# EAGLE board Player (EAGLE 7.5.0), part 1 of 2
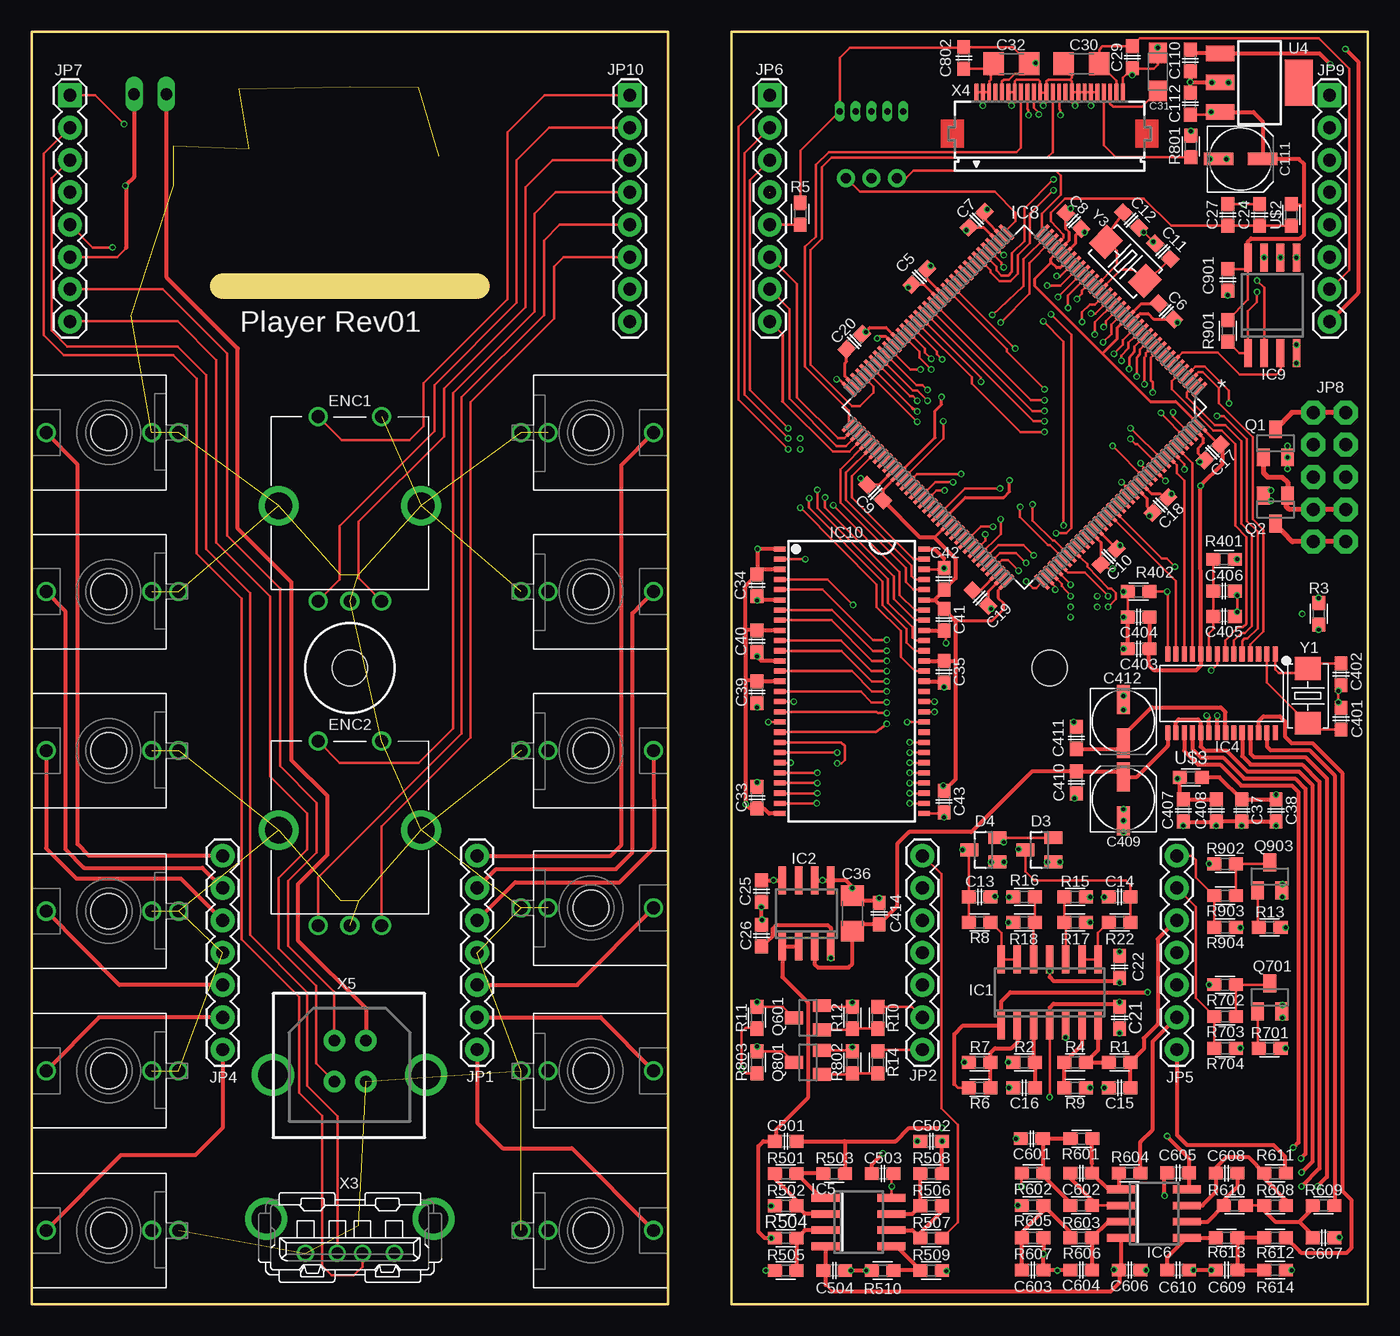
[diagram p3: board, top side]
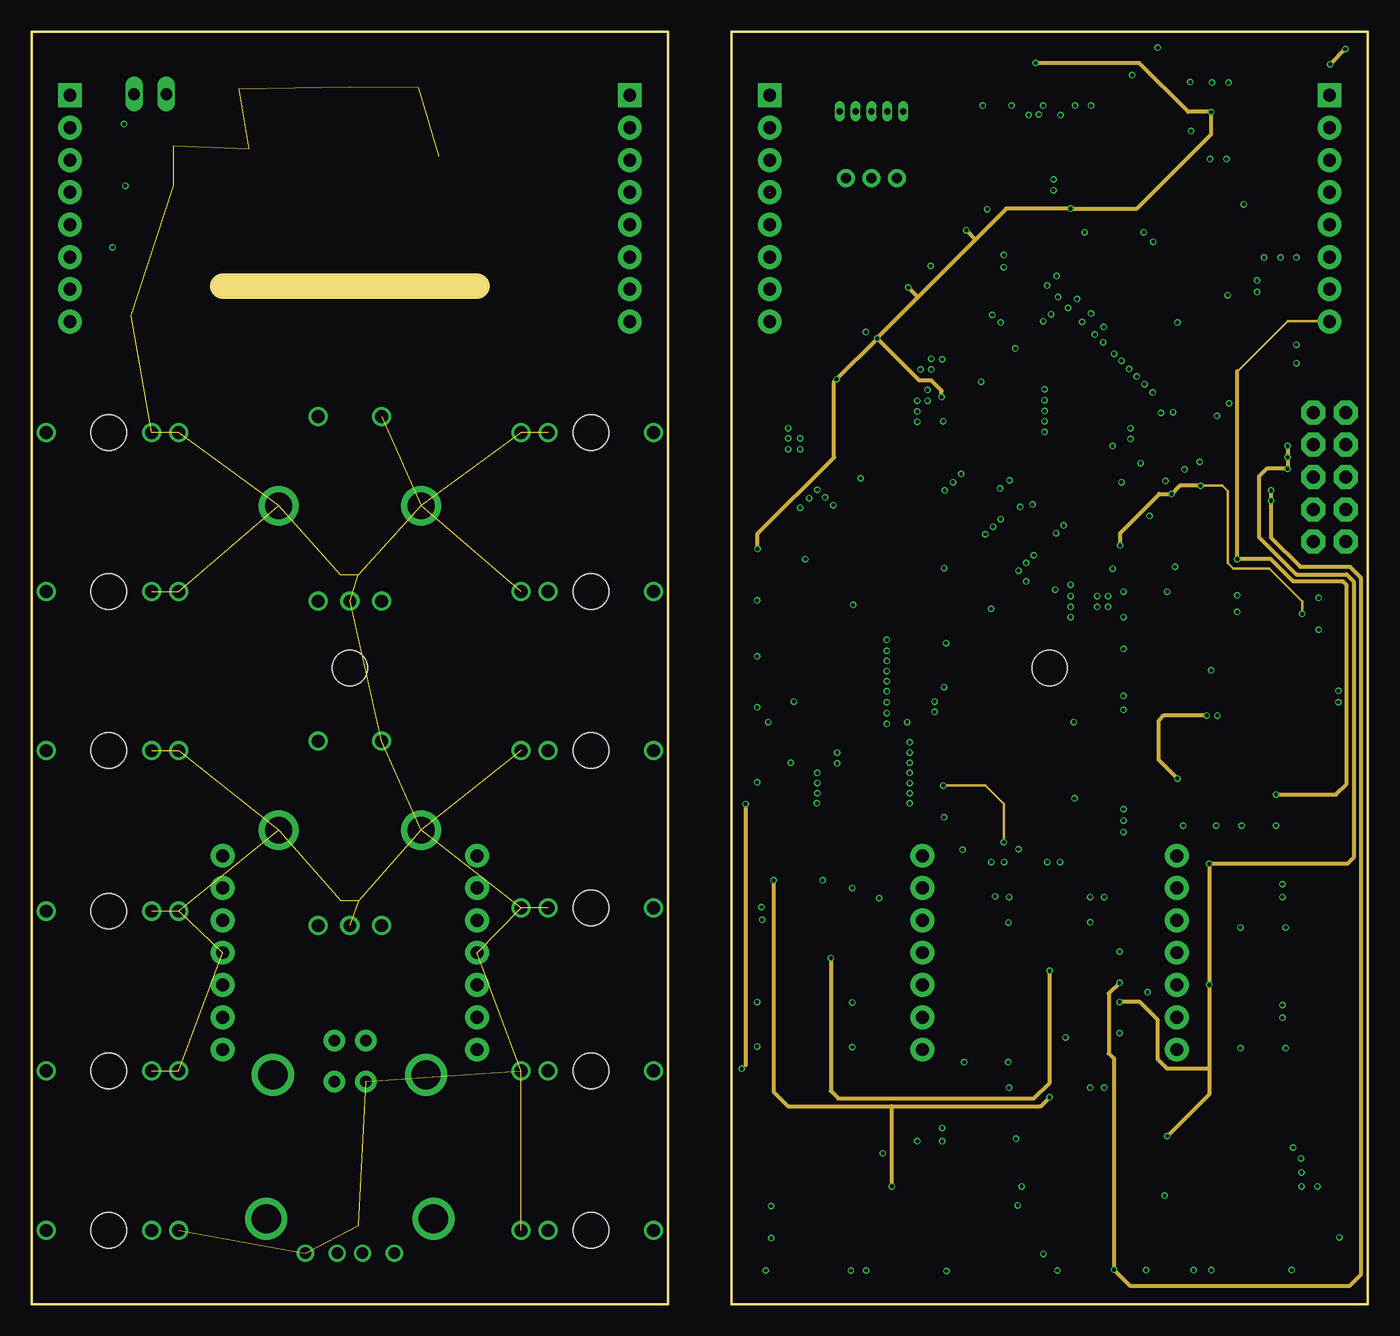
[diagram p4: board, inner layer InnerTop]
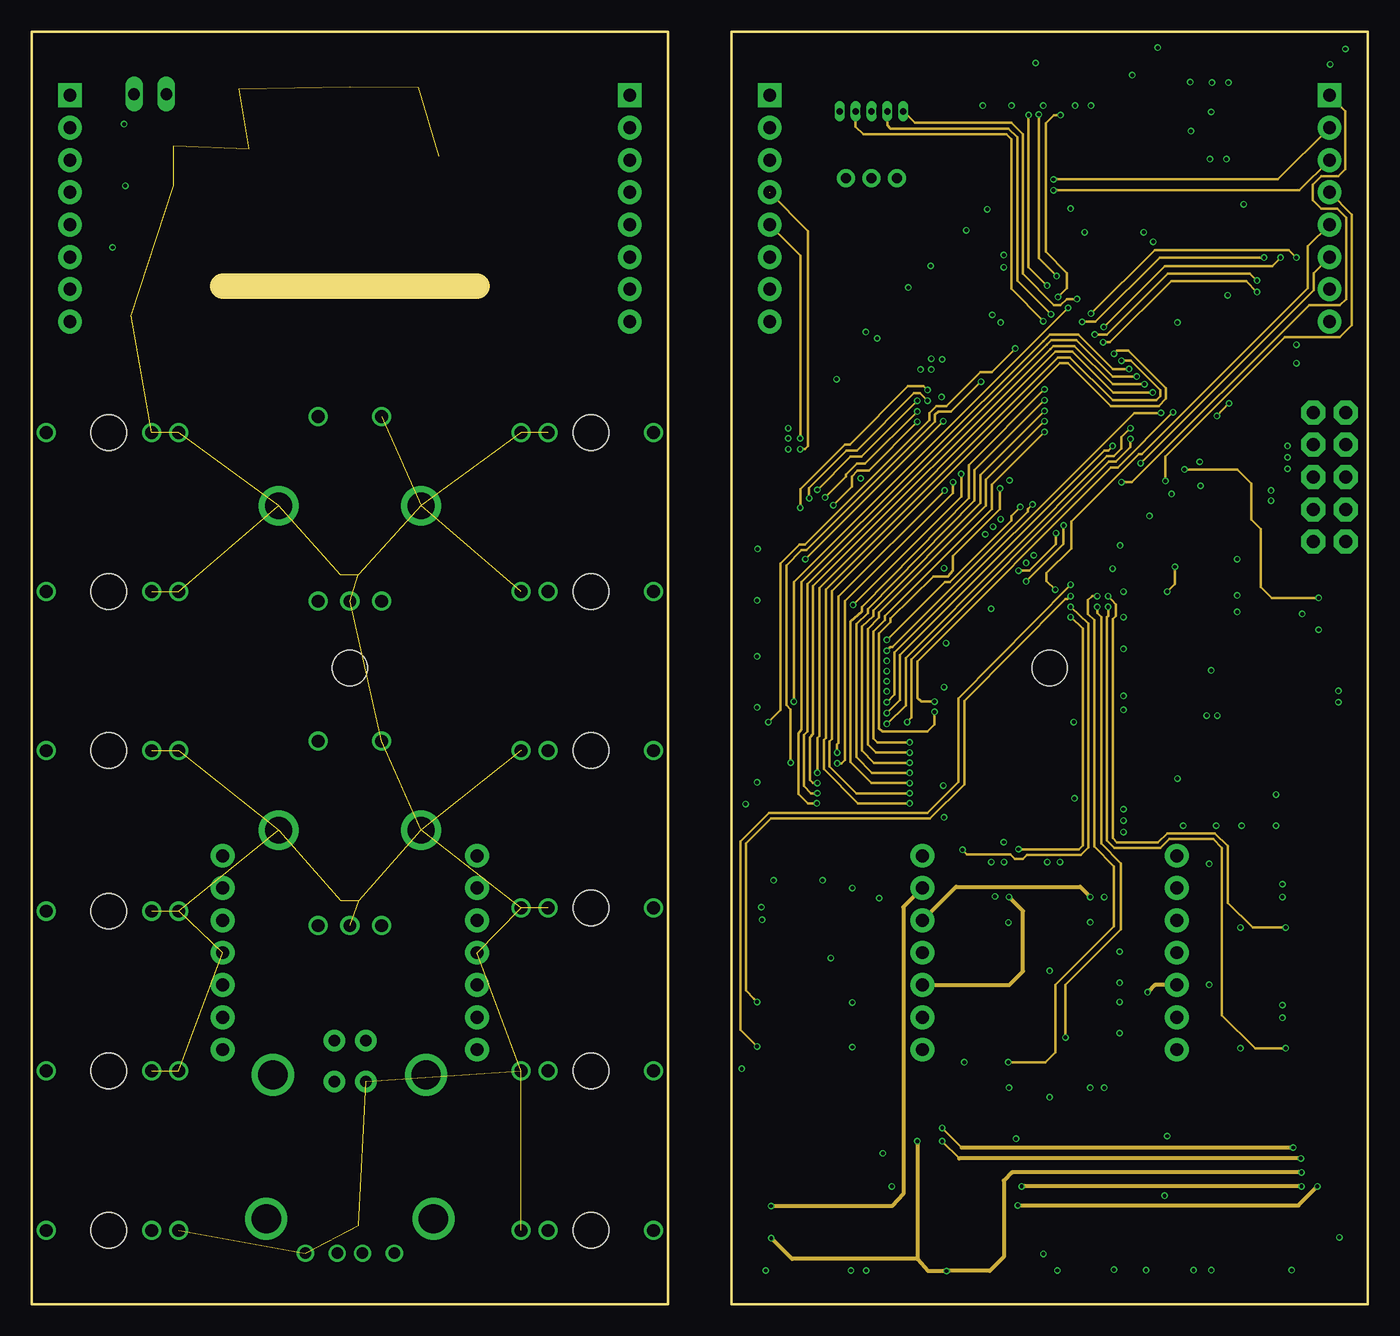
[diagram p5: board, inner layer InnerBottom]
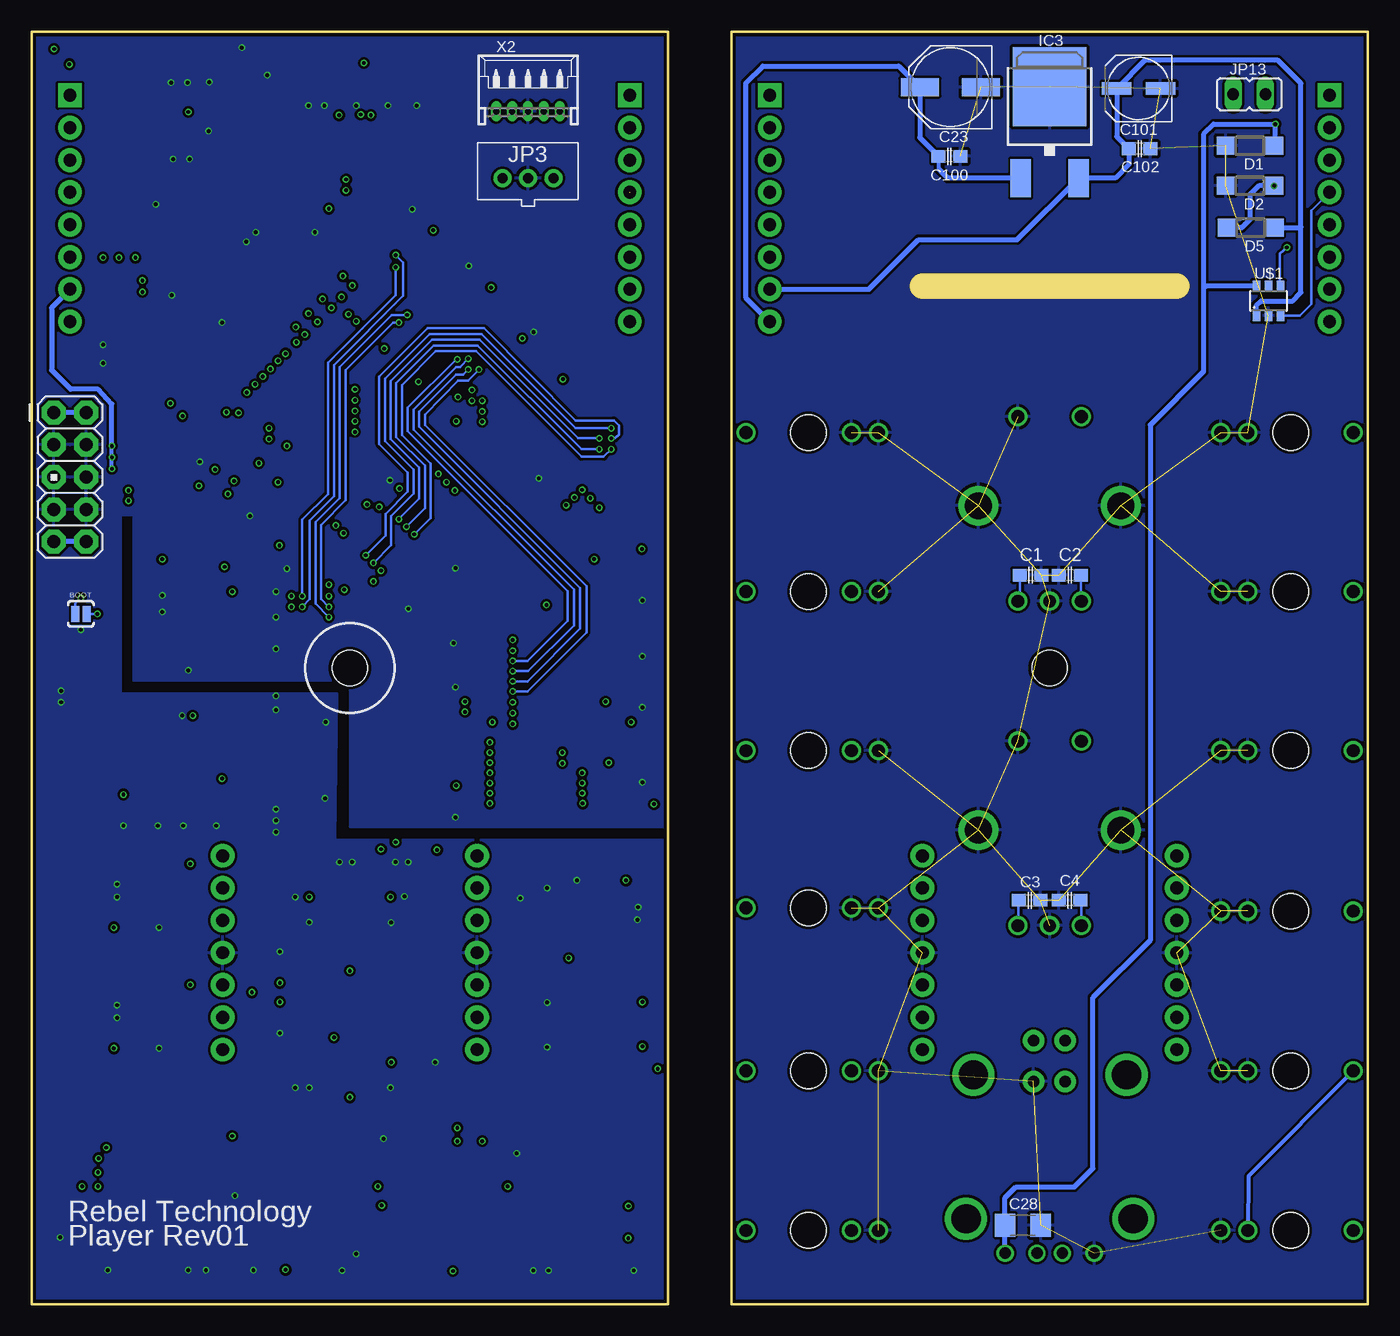
[diagram p6: board, bottom side, seen from below]

Size 105 x 100 mm. Coordinates in mm from the lower left corner, seen from the top.
Outline: 55,0 105,0 105,100 55,100 55,0
Outline: 50,100 0,100 0,0 50,0 50,100
Copper layers (1*2*15*16): Top 0.035mm / dielectric 0.2mm / InnerTop 0.0175mm / dielectric 0.3mm / InnerBottom 0.0175mm / dielectric 0.2mm / Bottom 0.035mm
Design rules "SeeedStudio_4layer_DRU_no_angle_20140221": minimum track width 8mil, minimum drill 12mil, track to track 8mil, track to pad 8mil, pad to pad 8mil, via to via 8mil, smd to smd 0mil, copper to edge 10mil, drill to drill 8mil, minimum pad ring 6mil, minimum via ring 4mil, stop-mask expansion 4mil, vias tented up to drill 25mil, thermal gap 10mil
Net classes: 1 power: width 0.178 mm, drill 0.305 mm, clearance 0.178 mm to class 0, clearance 0.178 mm
Holes 2.8 mm at 25,50 80,50
Milling: 1 lines

## Footprints (pad centres in the part's own frame; a part is rotated, then mirrored left to right if it is on the bottom)
SJ_2S-NO = smd 0.635 x 1.27: 1 -0.45,0; 2 0.45,0
C0603 = smd 1.1 x 1: 1 -0.85,0; 2 0.85,0
PANASONIC_D = smd 3 x 1.4: + 2.4,0; - -2.4,0
C1206 = smd 1.6 x 1.8: 1 -1.4,0; 2 1.4,0
SMC_A = smd 1.6 x 1.4: + -1.5,0; - 1.5,0
CPOL-5 = smd 2.3 x 1: + 1.725,0; - -1.725,0
THONKICONN = drill 1: P$1 0,-5.5; P$2 0,-3.38; P$3 0,4.92 | hole 2.8: 0,0
SOD123 = smd 1.4 x 1.4: A 1.9,0; C -1.9,0
SOT23 = smd 1 x 1.4: 1 -0.95,-1.1; 2 0.95,-1.1; 3 0,1.1
EC12E2424407 = drill 1: C 0,-7.5; PINA -2.5,-7.5; PINB 2.5,-7.5; SWITCH1 -2.5,7; SWITCH2 2.5,7 | drill 2.1: P$1 -5.6,0; P$2 5.6,0
SO14 = smd 0.6 x 2.2: 1 -3.81,-2.6; 2 -2.54,-2.6; 3 -1.27,-2.6; 4 0,-2.6; 5 1.27,-2.6; 6 2.54,-2.6; 7 3.81,-2.6; 8 3.81,2.6; 9 2.54,2.6; 10 1.27,2.6; 11 0,2.6; 12 -1.27,2.6; 13 -2.54,2.6; 14 -3.81,2.6
SO08 = smd 0.6 x 2.2: 1 -1.905,-2.6; 2 -0.635,-2.6; 3 0.635,-2.6; 4 1.905,-2.6; 5 1.905,2.6; 6 0.635,2.6; 7 -0.635,2.6; 8 -1.905,2.6
DPACK = smd 1.6 x 3: 1 -2.28,-4.8; 3 2.28,-4.8 | smd 5.8 x 6.2: 4 0,2.38
TSSOP28-0.65-9.7X4.4MM = smd 0.4 x 1.15: 1 -4.225,-3.1; 2 -3.575,-3.1; 3 -2.925,-3.1; 4 -2.275,-3.1; 5 -1.625,-3.1; 6 -0.975,-3.1; 7 -0.325,-3.1; 8 0.325,-3.1; 9 0.975,-3.1; 10 1.625,-3.1; 11 2.275,-3.1; 12 2.925,-3.1; 13 3.575,-3.1; 14 4.225,-3.1; 15 4.225,3.1; 16 3.575,3.1; 17 2.925,3.1; 18 2.275,3.1; 19 1.625,3.1; 20 0.975,3.1; 21 0.325,3.1; 22 -0.325,3.1; 23 -0.975,3.1; 24 -1.625,3.1; 25 -2.275,3.1; 26 -2.925,3.1; 27 -3.575,3.1; 28 -4.225,3.1
QFP50P2200X2200X160-144N = smd 1.473 x 0.279: 1 -10.719,8.738; 2 -10.719,8.255; 3 -10.719,7.747; 4 -10.719,7.239; 5 -10.719,6.756; 6 -10.719,6.248; 7 -10.719,5.74; 8 -10.719,5.258; 9 -10.719,4.75; 10 -10.719,4.242; 11 -10.719,3.759; 12 -10.719,3.251; 13 -10.719,2.743; 14 -10.719,2.261; 15 -10.719,1.753; 16 -10.719,1.245; 17 -10.719,0.762; 18 -10.719,0.254; 19 -10.719,-0.254; 20 -10.719,-0.762; 21 -10.719,-1.245; 22 -10.719,-1.753; 23 -10.719,-2.261; 24 -10.719,-2.743; 25 -10.719,-3.251; 26 -10.719,-3.759; 27 -10.719,-4.242; 28 -10.719,-4.75; 29 -10.719,-5.258; 30 -10.719,-5.74; 31 -10.719,-6.248; 32 -10.719,-6.756; 33 -10.719,-7.239; 34 -10.719,-7.747; 35 -10.719,-8.255; 36 -10.719,-8.738; 73 10.719,-8.738; 74 10.719,-8.255; 75 10.719,-7.747; 76 10.719,-7.239; 77 10.719,-6.756; 78 10.719,-6.248; 79 10.719,-5.74; 80 10.719,-5.258; 81 10.719,-4.75; 82 10.719,-4.242; 83 10.719,-3.759; 84 10.719,-3.251; 85 10.719,-2.743; 86 10.719,-2.261; 87 10.719,-1.753; 88 10.719,-1.245; 89 10.719,-0.762; 90 10.719,-0.254; 91 10.719,0.254; 92 10.719,0.762; 93 10.719,1.245; 94 10.719,1.753; 95 10.719,2.261; 96 10.719,2.743; 97 10.719,3.251; 98 10.719,3.759; 99 10.719,4.242; 100 10.719,4.75; 101 10.719,5.258; 102 10.719,5.74; 103 10.719,6.248; 104 10.719,6.756; 105 10.719,7.239; 106 10.719,7.747; 107 10.719,8.255; 108 10.719,8.738 | smd 0.279 x 1.473: 37 -8.738,-10.719; 38 -8.255,-10.719; 39 -7.747,-10.719; 40 -7.239,-10.719; 41 -6.756,-10.719; 42 -6.248,-10.719; 43 -5.74,-10.719; 44 -5.258,-10.719; 45 -4.75,-10.719; 46 -4.242,-10.719; 47 -3.759,-10.719; 48 -3.251,-10.719; 49 -2.743,-10.719; 50 -2.261,-10.719; 51 -1.753,-10.719; 52 -1.245,-10.719; 53 -0.762,-10.719; 54 -0.254,-10.719; 55 0.254,-10.719; 56 0.762,-10.719; 57 1.245,-10.719; 58 1.753,-10.719; 59 2.261,-10.719; 60 2.743,-10.719; 61 3.251,-10.719; 62 3.759,-10.719; 63 4.242,-10.719; 64 4.75,-10.719; 65 5.258,-10.719; 66 5.74,-10.719; 67 6.248,-10.719; 68 6.756,-10.719; 69 7.239,-10.719; 70 7.747,-10.719; 71 8.255,-10.719; 72 8.738,-10.719; 109 8.738,10.719; 110 8.255,10.719; 111 7.747,10.719; 112 7.239,10.719; 113 6.756,10.719; 114 6.248,10.719; 115 5.74,10.719; 116 5.258,10.719; 117 4.75,10.719; 118 4.242,10.719; 119 3.759,10.719; 120 3.251,10.719; 121 2.743,10.719; 122 2.261,10.719; 123 1.753,10.719; 124 1.245,10.719; 125 0.762,10.719; 126 0.254,10.719; 127 -0.254,10.719; 128 -0.762,10.719; 129 -1.245,10.719; 130 -1.753,10.719; 131 -2.261,10.719; 132 -2.743,10.719; 133 -3.251,10.719; 134 -3.759,10.719; 135 -4.242,10.719; 136 -4.75,10.719; 137 -5.258,10.719; 138 -5.74,10.719; 139 -6.248,10.719; 140 -6.756,10.719; 141 -7.239,10.719; 142 -7.747,10.719; 143 -8.255,10.719; 144 -8.738,10.719
SO8W = smd 0.6 x 2.2: 1 -1.905,-3.75; 2 -0.635,-3.75; 3 0.635,-3.75; 4 1.905,-3.75; 5 1.905,3.75; 6 0.635,3.75; 7 -0.635,3.75; 8 -1.905,3.75
TSOP54-400 = smd 0.4 x 0.9: 1 -10.4,-5.68; 2 -9.6,-5.68; 3 -8.8,-5.68; 4 -8,-5.68; 5 -7.2,-5.68; 6 -6.4,-5.68; 7 -5.6,-5.68; 8 -4.8,-5.68; 9 -4,-5.68; 10 -3.2,-5.68; 11 -2.4,-5.68; 12 -1.6,-5.68; 13 -0.8,-5.68; 14 0,-5.68; 15 0.8,-5.68; 16 1.6,-5.68; 17 2.4,-5.68; 18 3.2,-5.68; 19 4,-5.68; 20 4.8,-5.68; 21 5.6,-5.68; 22 6.4,-5.68; 23 7.2,-5.68; 24 8,-5.68; 25 8.8,-5.68; 26 9.6,-5.68; 27 10.4,-5.68; 28 10.4,5.68; 29 9.6,5.68; 30 8.8,5.68; 31 8,5.68; 32 7.2,5.68; 33 6.4,5.68; 34 5.6,5.68; 35 4.8,5.68; 36 4,5.68; 37 3.2,5.68; 38 2.4,5.68; 39 1.6,5.68; 40 0.8,5.68; 41 0,5.68; 42 -0.8,5.68; 43 -1.6,5.68; 44 -2.4,5.68; 45 -3.2,5.68; 46 -4,5.68; 47 -4.8,5.68; 48 -5.6,5.68; 49 -6.4,5.68; 50 -7.2,5.68; 51 -8,5.68; 52 -8.8,5.68; 53 -9.6,5.68; 54 -10.4,5.68
1X07 = drill 1.016 pad 1.88: 1 0,0; 2 2.54,0; 3 5.08,0; 4 7.62,0; 5 10.16,0; 6 12.7,0; 7 15.24,0
JST-B3B-PH-KL = drill 0.8 pad 1.422: 1 2,0; 2 0,0; 3 -2,0
1X08 = drill 1.016 pad 1.88 square: 1 0,0 | drill 1.016 pad 1.88: 2 2.54,0; 3 5.08,0; 4 7.62,0; 5 10.16,0; 6 12.7,0; 7 15.24,0; 8 17.78,0
AVR_ICSP = drill 1.016 pad 1.88 octagon: 1 -1.27,5.08; 2 1.27,5.08; 3 -1.27,2.54; 4 1.27,2.54; 5 -1.27,0; 6 1.27,0; 7 -1.27,-2.54; 8 1.27,-2.54; 9 -1.27,-5.08; 10 1.27,-5.08
JP1 = drill 0.914 long: 1 0,-1.27; 2 0,1.27
0603 = smd 1.1 x 1: 1 -0.85,0; 2 0.85,0
SOT223 = smd 1.219 x 2.235: 1 -2.311,-3.099; 2 0,-3.099; 3 2.311,-3.099 | smd 3.6 x 2.2: 4 0,3.099
SOT23-6 = smd 0.6 x 0.9: 1 -0.95,-1.15; 2 0,-1.15; 3 0.95,-1.15; 4 0.95,1.15; 5 0,1.15; 6 -0.95,1.15
53048-05 = drill 0.5 pad 0.698 long: 1 2.5,-1.25; 2 1.25,-1.25; 3 0,-1.25; 4 -1.25,-1.25; 5 -2.5,-1.25
KUSBVX = drill 0.9 pad 1.3: 1 3.5,0; 2 1,0; 3 -1,0; 4 -3.5,0 | drill 2.3 pad 2.8: M1 -6.57,2.71; M2 6.57,2.71
FH12-24S-0.5SH = smd 0.3 x 1.3: 1 -5.75,3.25; 2 -5.25,3.25; 3 -4.75,3.25; 4 -4.25,3.25; 5 -3.75,3.25; 6 -3.25,3.25; 7 -2.75,3.25; 8 -2.25,3.25; 9 -1.75,3.25; 10 -1.25,3.25; 11 -0.75,3.25; 12 -0.25,3.25; 13 0.25,3.25; 14 0.75,3.25; 15 1.25,3.25; 16 1.75,3.25; 17 2.25,3.25; 18 2.75,3.25; 19 3.25,3.25; 20 3.75,3.25; 21 4.25,3.25; 22 4.75,3.25; 23 5.25,3.25; 24 5.75,3.25
USB-B-PTH-VERTICAL = drill 0.914 pad 1.676: D+ 4.826,4.394; D- 4.826,7.595; GND 7.315,4.394; VBUS 7.315,7.595 | drill 2.286: P$1 0,4.902; P$2 12.04,4.902
X2-SMD-5.0X3.2X1.3MM = smd 1.778 x 2.032: 1 -2.159,0; 2 2.159,0

## Placement (x,y rotation side)
BOOT  SOLDERJUMPERNO  [SJ_2S-NO]  101.15,54.25 0 bottom
C1  100n  [C0603]  26.49,57.29 180 bottom
C2  100n  [C0603]  23.41,57.29 0 bottom
C3  100n  [C0603]  26.56,31.74 180 bottom
C4  100n  [C0603]  23.43,31.74 0 bottom
C5  100n  [C0603]  69.76,80.73 45 top
C6  100n  [C0603]  89.17,78.03 315 top
C7  100n  [C0603]  74.27,85.22 45 top
C8  100n  [C0603]  81.88,85.12 315 top
C9  100n  [C0603]  66.28,63.78 135 top
C10  100n  [C0603]  84.64,58.75 225 top
C11  20pF  [C0603]  88.9,82.75 135 top
C12  20pF  [C0603]  86.4,85.2 315 top
C13  100n  [C0603]  74.5,32 0 top
C14  100n  [C0603]  85.5,32 180 top
C15  100n  [C0603]  85.5,17 180 top
C16  100n  [C0603]  78,17 180 top
C17  10n C0G  [C0603]  92.8,66.95 225 top
C18  1u  [C0603]  88.7,62.8 225 top
C19  2u2 C0G  [C0603]  74.55,55.5 315 top
C20  2u2 C0G  [C0603]  64.65,75.65 45 top
C21  100n  [C0603]  85.5,22.5 270 top
C22  100n  [C0603]  85.5,26.5 90 top
C23  220u  [PANASONIC_D]  32.8,95.65 180 bottom
C24  100n  [C0603]  96.5,85.6 90 top
C25  100n  [C0603]  57.35,32.45 270 top
C26  100n  [C0603]  57.35,28.95 90 top
C27  10n  [C0603]  94,85.6 90 top
C28  10u  [C1206]  27.1,6.2 0 bottom
C29  100n  [C0603]  86.5,98 90 top
C30  10u  [C1206]  82.5,97.5 0 top
C31  4u7 16V Tantalum  [SMC_A]  88.5,96.85 90 top
C32  10u  [C1206]  77,97.5 0 top
C33  100n  [C0603]  57,39.8 90 top
C34  100n  [C0603]  57,56.5 270 top
C35  100n  [C0603]  71.7,49.7 270 top
C36  10u  [C1206]  64.5,30.7 270 top
C37  100n  [C0603]  95.1,38.8 270 top
C38  10u  [C0603]  97.8,38.8 270 top
C39  100n  [C0603]  57,48.1 270 top
C40  100n  [C0603]  57,52.1 270 top
C41  100n  [C0603]  71.7,53.8 270 top
C42  100n  [C0603]  71.7,57 90 top
C43  100n  [C0603]  71.7,39.5 270 top
C100  100n  [C0603]  32.88,90.2 0 bottom
C101  47u  [CPOL-5]  18,95.55 180 bottom
C102  100n  [C0603]  17.91,90.81 0 bottom
C110  100n  [C0603]  91.05,97.75 90 top
C111  47u  [CPOL-5]  95,90 0 top
C112  100n  [C0603]  91.05,94.35 90 top
C401  39pF C0G  [C0603]  102.9,46 90 top
C402  39pF C0G  [C0603]  102.9,49.5 270 top
C403  1u  [C0603]  87,51.5 180 top
C404  100n  [C0603]  87,54 180 top
C405  100n  [C0603]  93.7,54.05 0 top
C406  1u  [C0603]  93.7,56.05 0 top
C407  1u  [C0603]  90.5,38.8 270 top
C408  100n  [C0603]  93.1,38.8 270 top
C409  10u  [CPOL-5]  85.8,39.7 90 top
C410  100n  [C0603]  82.1,41 270 top
C411  100n  [C0603]  82.1,44.5 90 top
C412  47u  [CPOL-5]  85.8,45.8 270 top
C414  100n  [C0603]  66.6,30.7 90 top
C501  100n C0G  [C0603]  59.27,12.8 180 top
C502  100n C0G  [C0603]  70.7,12.8 180 top
C503  100n  [C0603]  66.89,10.26 180 top
C504  100n  [C0603]  63.08,2.64 0 top
C601  1n C0G  [C0603]  78.6,13 0 top
C602  100p C0G  [C0603]  82.48,10.29 0 top
C603  1n C0G  [C0603]  78.67,2.67 0 top
C604  100p C0G  [C0603]  82.48,2.67 180 top
C605  100n  [C0603]  90.09,10.31 180 top
C606  100n  [C0603]  86.3,2.67 0 top
C607  1n C0G  [C0603]  101.53,5.21 180 top
C608  100p C0G  [C0603]  93.92,10.29 180 top
C609  1n C0G  [C0603]  93.92,2.67 180 top
C610  100p C0G  [C0603]  90.11,2.67 0 top
C802  100n  [C0603]  73.25,97.95 90 top
C901  100n  [C0603]  94,80.5 270 top
CVINA  THONKICONN  [THONKICONN]  6.05,43.5 90 top
CVINB  THONKICONN  [THONKICONN]  6.05,30.89 90 top
CVOUTA  THONKICONN  [THONKICONN]  43.95,43.5 270 top
CVOUTB  THONKICONN  [THONKICONN]  43.95,31.14 270 top
D1  B130LAW-7-F  [SOD123]  9.25,91.05 180 bottom
D2  B130LAW-7-F  [SOD123]  9.25,87.9 180 bottom
D3  BAT54S  [SOT23]  79.2,35.7 90 top
D4  BAT54S  [SOT23]  74.8,35.7 90 top
D5  B130LAW-7-F  [SOD123]  9.2,84.6 180 bottom
ENC1  EC12E2424407  [EC12E2424407]  25,62.75 0 top
ENC2  EC12E2424407  [EC12E2424407]  25,37.25 0 top
IC1  TL074D  [SO14]  80,24.5 0 top
IC2  NE5532D  [SO08]  60.9,30.7 0 top
IC3  MC7805CDTG  [DPACK]  25,93.3 0 bottom
IC4  CS4271  [TSSOP28-0.65-9.7X4.4MM]  93.5,48 180 top
IC5  NE5532D  [SO08]  64.98,6.45 270 top
IC6  NE5532D  [SO08]  88.2,7.12 270 top
IC8  STM32F756ZLQFP144  [QFP50P2200X2200X160-144N]  78,70.5 225 top
IC9  N25Q128A13  [SO8W]  97.5,78.5 0 top
IC10  IS42S16400J  [TSOP54-400]  64.45,48.95 270 top
INL  THONKICONN  [THONKICONN]  6.05,18.34 90 top
INR  THONKICONN  [THONKICONN]  6.05,5.79 90 top
JP1  [1X07]  35,20 90 top
JP2  [1X07]  70,20 90 top
JP3  [JST-B3B-PH-KL]  66,88.5 0 bottom
JP4  [1X07]  15,20 90 top
JP5  [1X07]  90,20 90 top
JP6  [1X08]  58,95 270 top
JP7  [1X08]  3,95 270 top
JP8  M05X2PTH  [AVR_ICSP]  102,65 0 bottom
JP9  [1X08]  102,95 270 top
JP10  [1X08]  47,95 270 top
JP13  [JP1]  9.3,95.1 90 bottom
OUTL  THONKICONN  [THONKICONN]  43.95,18.34 270 top
OUTR  THONKICONN  [THONKICONN]  43.95,5.79 270 top
Q1  BSS84  [SOT23]  97.75,67.65 0 top
Q2  BSS123  [SOT23]  97.75,62.45 180 top
Q601  BC846  [SOT23]  61,22.5 90 top
Q701  BC846  [SOT23]  97.3,24.1 0 top
Q801  BC846  [SOT23]  61,19 90 top
Q903  BC846  [SOT23]  97.3,33.6 0 top
R1  390  [0603]  85.5,19 0 top
R2  390  [0603]  78,19 0 top
R3  22R  [0603]  101.15,54.25 90 top
R4  20k  [0603]  82,19 0 top
R5  10k  [0603]  60.4,85.7 270 top
R6  20k  [0603]  74.5,17 180 top
R7  10k  [0603]  74.5,19 0 top
R8  390  [0603]  74.5,30 180 top
R9  10k  [0603]  82,17 180 top
R10  100k  [0603]  66.5,22.5 270 top
R11  10k  [0603]  57,22.5 90 top
R12  1M  [0603]  64.5,22.5 90 top
R13  1k  [0603]  97.3,29.6 0 top
R14  100k  [0603]  66.5,19 270 top
R15  200k  [0603]  82,32 0 top
R16  200k  [0603]  78,32 180 top
R17  100k  [0603]  82,30 180 top
R18  100k  [0603]  78,30 0 top
R22  390  [0603]  85.5,30 0 top
R401  5R1  [0603]  93.7,58.55 0 top
R402  10k  [0603]  87,56 0 top
R501  20k  [0603]  59.27,10.26 0 top
R502  100k  [0603]  59.27,7.72 0 top
R503  390R  [0603]  63.08,10.26 0 top
R504  20k  [0603]  59.27,5.18 0 top
R505  100k  [0603]  59.27,2.64 180 top
R506  20k  [0603]  70.7,7.72 180 top
R507  100k  [0603]  70.7,5.18 180 top
R508  390R  [0603]  70.7,10.26 0 top
R509  20k  [0603]  70.7,2.64 180 top
R510  100k  [0603]  66.89,2.64 180 top
R601  22k  [0603]  82.5,13 180 top
R602  5k6  [0603]  78.67,10.29 180 top
R603  4k7  [0603]  82.48,7.75 180 top
R604  1k  [0603]  86.3,10.29 180 top
R605  5k6  [0603]  78.67,7.75 180 top
R606  4k7  [0603]  82.48,5.21 180 top
R607  22k  [0603]  78.67,5.21 0 top
R608  22k  [0603]  97.72,7.75 180 top
R609  5k6  [0603]  101.53,7.75 0 top
R610  4k7  [0603]  94.55,7.75 0 top
R611  1k  [0603]  97.72,10.29 180 top
R612  5k6  [0603]  97.72,5.21 0 top
R613  4k7  [0603]  93.92,5.21 0 top
R614  22k  [0603]  97.72,2.67 0 top
R701  1k  [0603]  97.3,20.1 0 top
R702  1k  [0603]  93.8,25.1 180 top
R703  100R  [0603]  93.8,22.6 180 top
R704  1k  [0603]  93.8,20.1 180 top
R801  560k  [0603]  91.1,91 270 top
R802  1M  [0603]  64.5,19 90 top
R803  10k  [0603]  57,19 90 top
R901  10k  [0603]  94,76.5 270 top
R902  1k  [0603]  93.8,34.6 0 top
R903  100R  [0603]  93.8,32.1 180 top
R904  1k  [0603]  93.8,29.6 180 top
TRINA  THONKICONN  [THONKICONN]  6.05,68.5 90 top
TRINB  THONKICONN  [THONKICONN]  6.05,56 90 top
TROUTA  THONKICONN  [THONKICONN]  43.95,68.5 270 top
TROUTB  THONKICONN  [THONKICONN]  43.95,56 270 top
U4  V_REG_LM3940IMP  [SOT223]  96.5,96 270 top
U$1  MIC2005  [SOT23-6]  7.8,78.85 0 bottom
U$2  1uH  [0603]  99,85.6 90 top
U$3  1uH  [0603]  91.1,41.4 180 top
X2  53048-05  [53048-05]  66,95 0 bottom
X3  KUSBVX  [KUSBVX]  25,4 0 top
X4  FH12-24S-0.5SH  [FH12-24S-0.5SH]  80,92 0 top
X5  USBPTH-VERTICAL  [USB-B-PTH-VERTICAL]  18.95,13.1 0 top
Y1  24.576MHz  [X2-SMD-5.0X3.2X1.3MM]  100.3,47.8 270 top
Y3  25MHz  [X2-SMD-5.0X3.2X1.3MM]  85.95,81.95 315 top